# Altium schematic sheet custom_line_V1_mux6.SchDoc
size 209 x 297 mm
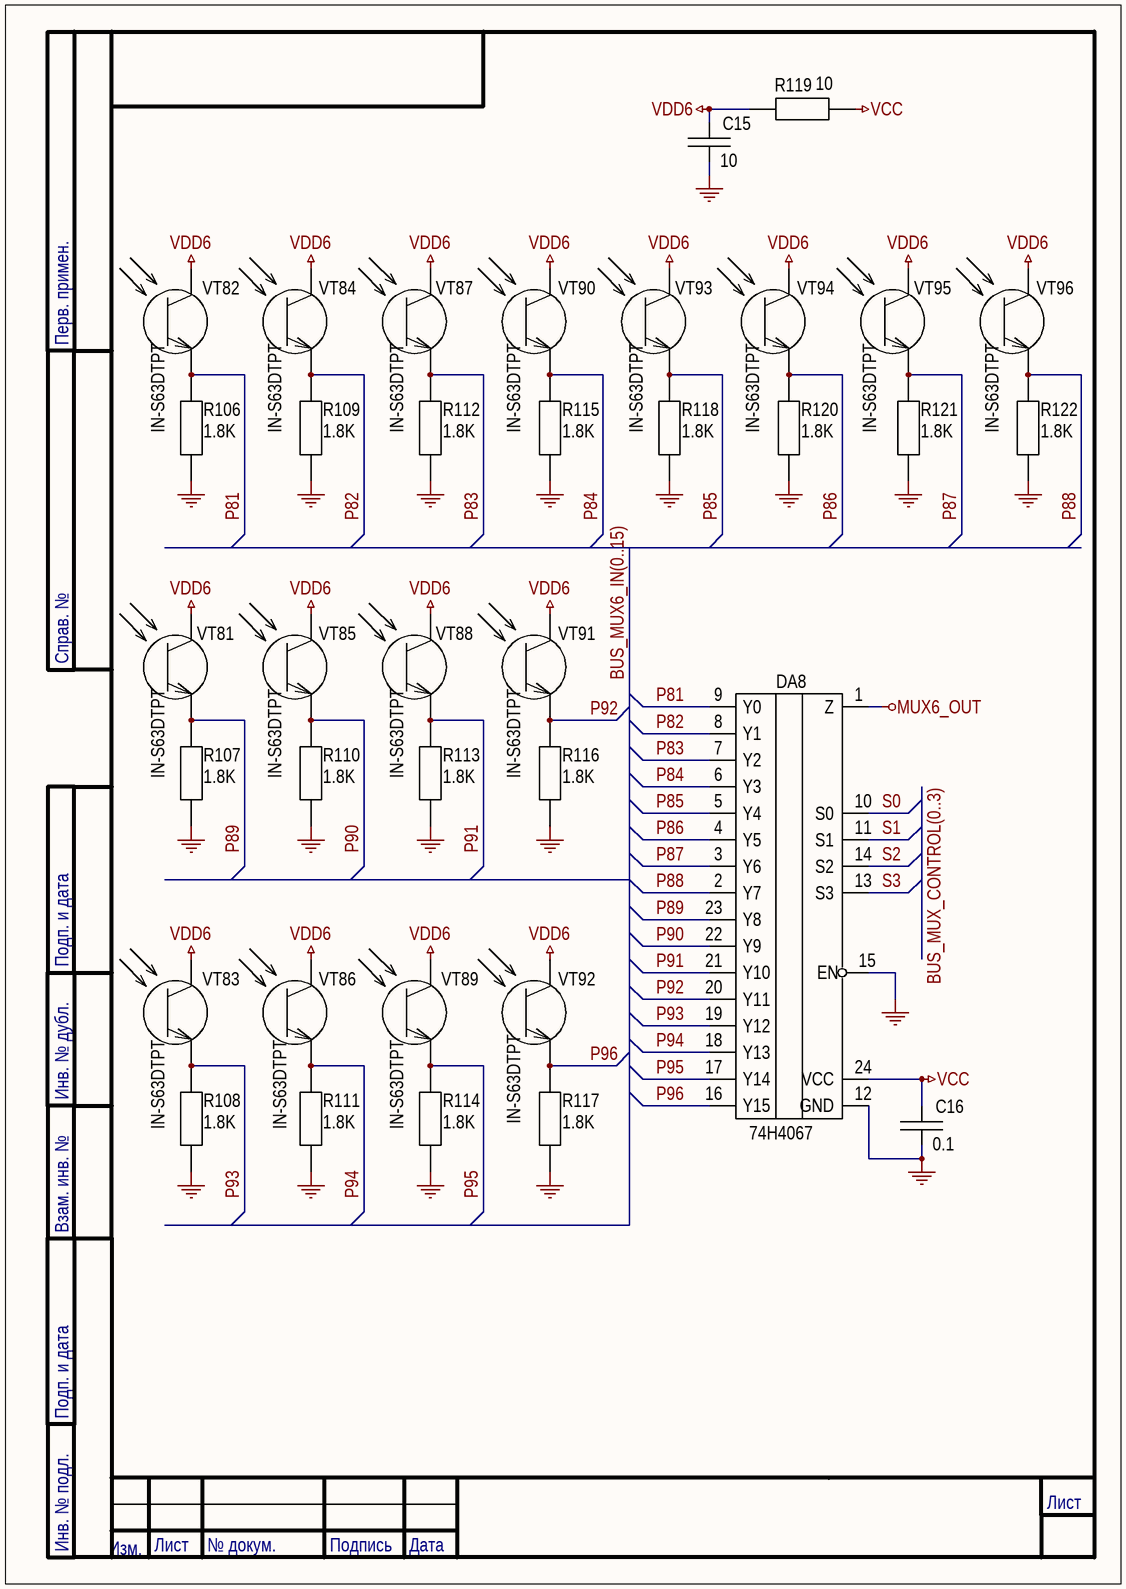
[diagram p0: custom_line_V1_mux6.SchDoc]

## Parts
C15  10  [CC_0805]
C16  0.1  [CC_0603]
DA8  type: 74H4067  [TSSOP-24]  (hidden comment: 74HC4067)
R106  1.8K  [RC_0603_SMALL]
R107  1.8K  [RC_0603_SMALL]
R108  1.8K  [RC_0603_SMALL]
R109  1.8K  [RC_0603_SMALL]
R110  1.8K  [RC_0603_SMALL]
R111  1.8K  [RC_0603_SMALL]
R112  1.8K  [RC_0603_SMALL]
R113  1.8K  [RC_0603_SMALL]
R114  1.8K  [RC_0603_SMALL]
R115  1.8K  [RC_0603_SMALL]
R116  1.8K  [RC_0603_SMALL]
R117  1.8K  [RC_0603_SMALL]
R118  1.8K  [RC_0603_SMALL]
R119  10  [RC_0603_SMALL]
R120  1.8K  [RC_0603_SMALL]
R121  1.8K  [RC_0603_SMALL]
R122  1.8K  [RC_0603_SMALL]
VT81  IN-S63DTPT  [LED_0603]
VT82  IN-S63DTPT  [LED_0603]
VT83  IN-S63DTPT  [LED_0603]
VT84  IN-S63DTPT  [LED_0603]
VT85  IN-S63DTPT  [LED_0603]
VT86  IN-S63DTPT  [LED_0603]
VT87  IN-S63DTPT  [LED_0603]
VT88  IN-S63DTPT  [LED_0603]
VT89  IN-S63DTPT  [LED_0603]
VT90  IN-S63DTPT  [LED_0603]
VT91  IN-S63DTPT  [LED_0603]
VT92  IN-S63DTPT  [LED_0603]
VT93  IN-S63DTPT  [LED_0603]
VT94  IN-S63DTPT  [LED_0603]
VT95  IN-S63DTPT  [LED_0603]
VT96  IN-S63DTPT  [LED_0603]

## Nets
GND: C15.1 C16.1 DA8.12(GND) DA8.15(EN) R106.1 R107.1 R108.1 R109.1 R110.1 R111.1 R112.1 R113.1 R114.1 R115.1 R116.1 R117.1 R118.1 R120.1 R121.1 R122.1
MUX6_OUT: DA8.1(Z)
VCC: C16.2 DA8.24(VCC) R119.1
VDD6: C15.2 R119.2 VT81.1(C) VT82.1(C) VT83.1(C) VT84.1(C) VT85.1(C) VT86.1(C) VT87.1(C) VT88.1(C) VT89.1(C) VT90.1(C) VT91.1(C) VT92.1(C) VT93.1(C) VT94.1(C) VT95.1(C) VT96.1(C)
P81: DA8.9(Y0) R106.2 VT82.2(E)
P82: DA8.8(Y1) R109.2 VT84.2(E)
P83: DA8.7(Y2) R112.2 VT87.2(E)
P84: DA8.6(Y3) R115.2 VT90.2(E)
P85: DA8.5(Y4) R118.2 VT93.2(E)
P86: DA8.4(Y5) R120.2 VT94.2(E)
P87: DA8.3(Y6) R121.2 VT95.2(E)
P88: DA8.2(Y7) R122.2 VT96.2(E)
P89: DA8.23(Y8) R107.2 VT81.2(E)
P90: DA8.22(Y9) R110.2 VT85.2(E)
P91: DA8.21(Y10) R113.2 VT88.2(E)
P92: DA8.20(Y11) R116.2 VT91.2(E)
P93: DA8.19(Y12) R108.2 VT83.2(E)
P94: DA8.18(Y13) R111.2 VT86.2(E)
P95: DA8.17(Y14) R114.2 VT89.2(E)
P96: DA8.16(Y15) R117.2 VT92.2(E)
S0: DA8.10(S0)
S1: DA8.11(S1)
S2: DA8.14(S2)
S3: DA8.13(S3)

## Buses and harness runs
bus BUS_MUX6_IN(0..15)
bus BUS_MUX_CONTROL(0..3)

## Notes on the sheet
- Перв. примен.
- Справ. №
- Подп. и дата
- Инв. № дубл.
- Взам. инв. №
- Изм.
- Лист
- Инв. № подл.
- № докум.
- Подпись
- Дата

## Library data of the parts
C15 = C: type: CC-0805-106-16V-X7R-10%; value: 10uF
C16 = C: type: CC-0603-B-104-K-50; value: 0.1uF
DA8 = 74HCT4067: 74HC4067PW
R106-R118 R120-R122 = R: power: 0.125W; value: 100K; type: RC-0603-104-5%
R119 = R: power: 0.125W; type: RC-0603-R10-5%; value: 10
VT81-VT96 = phototransistor: Phototransistor (Inolux); type: IN-S63DTPT